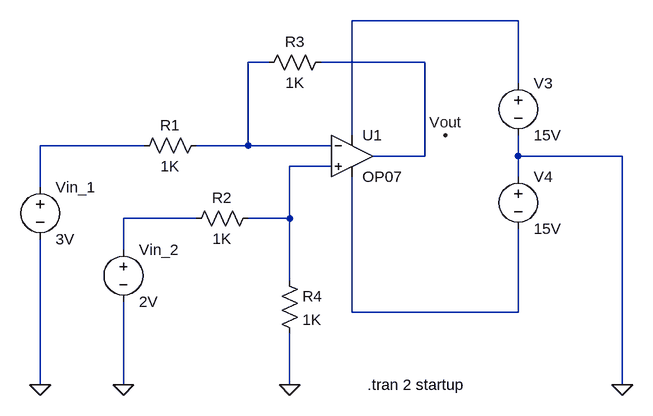
[diagram p0: schematic Exp 8 (Subtractor).asc]
Exp 8 (Subtractor).asc, the LTspice schematic file:
Version 4
SHEET 1 880 680
WIRE 352 -48 96 -48
WIRE -32 16 -64 16
WIRE 208 16 48 16
WIRE 352 48 352 -48
WIRE 96 128 96 -48
WIRE -224 144 -384 144
WIRE -64 144 -64 16
WIRE -64 144 -144 144
WIRE 64 144 -64 144
WIRE 208 160 208 16
WIRE 208 160 128 160
WIRE 352 160 352 128
WIRE 512 160 352 160
WIRE 64 176 0 176
WIRE 352 192 352 160
WIRE -384 208 -384 144
WIRE -144 256 -256 256
WIRE 0 256 0 176
WIRE 0 256 -64 256
WIRE -256 304 -256 256
WIRE 0 352 0 256
WIRE 96 400 96 192
WIRE 352 400 352 272
WIRE 352 400 96 400
WIRE -384 512 -384 288
WIRE -256 512 -256 384
WIRE 0 512 0 432
WIRE 512 512 512 160
FLAG 0 512 0
FLAG -384 512 0
FLAG -256 512 0
FLAG 512 512 0
FLAG 240 128 Vout
SYMBOL voltage 352 32 R0
WINDOW 123 0 0 Left 0
WINDOW 39 0 0 Left 0
SYMATTR InstName V3
SYMATTR Value 15V
SYMBOL voltage 352 176 R0
WINDOW 123 0 0 Left 0
WINDOW 39 0 0 Left 0
SYMATTR InstName V4
SYMATTR Value 15V
SYMBOL res 64 0 R90
WINDOW 0 0 56 VBottom 2
WINDOW 3 32 56 VTop 2
SYMATTR InstName R3
SYMATTR Value 1K
SYMBOL res -16 336 R0
SYMATTR InstName R4
SYMATTR Value 1K
SYMBOL res -128 128 R90
WINDOW 0 0 56 VBottom 2
WINDOW 3 32 56 VTop 2
SYMATTR InstName R1
SYMATTR Value 1K
SYMBOL res -48 240 R90
WINDOW 0 0 56 VBottom 2
WINDOW 3 32 56 VTop 2
SYMATTR InstName R2
SYMATTR Value 1K
SYMBOL voltage -384 192 R0
WINDOW 123 0 0 Left 0
WINDOW 39 0 0 Left 0
SYMATTR InstName Vin_1
SYMATTR Value 3V
SYMBOL voltage -256 288 R0
WINDOW 123 0 0 Left 0
WINDOW 39 0 0 Left 0
SYMATTR InstName Vin_2
SYMATTR Value 2V
SYMBOL OpAmps\\OP07 96 96 R0
SYMATTR InstName U1
TEXT 120 512 Left 2 !.tran 2 startup

The netlist it stands for:
* Exp 8 (Subtractor).asc
V3 N001 0 15V
V4 0 N007 15V
R3 N003 N002 1K
R4 N005 0 1K
R1 N002 N004 1K
R2 N005 N006 1K
Vin_1 N004 0 3V
Vin_2 N006 0 2V
XU1 N005 N002 N001 N007 N003 LT1001  ; OP07, pins In+ In- V+ V- OUT
.tran 2 startup
.lib LTC.lib
.backanno
.end